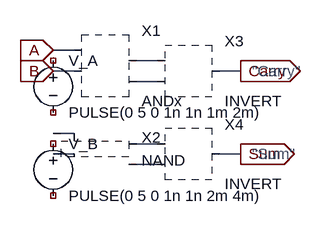
[diagram p0: schematic half-adder-test.asc]
half-adder-test.asc, the LTspice schematic file:
Version 4
SHEET 1 880 680
* Input A path
WIRE 176 128 144 128
WIRE 176 160 144 160
WIRE 304 144 272 144
WIRE 304 176 272 176

* Input B path
WIRE 176 256 144 256
WIRE 176 288 144 288
WIRE 304 272 272 272
WIRE 304 304 272 304

* Output paths
WIRE 432 160 400 160
WIRE 432 288 400 288

* Input flags
FLAG 144 128 A
IOPIN 144 128 In
FLAG 144 160 B
IOPIN 144 160 In

* Output flags
FLAG 432 160 Carry
IOPIN 432 160 Out
FLAG 432 288 Sum
IOPIN 432 288 Out

* Gate symbols with consistent spacing
SYMBOL ANDx 224 144 R0
SYMATTR InstName X1

SYMBOL NAND 224 272 R0
SYMATTR InstName X2
Q
SYMBOL INVERT 352 144 R0
SYMATTR InstName X3

SYMBOL INVERT 352 272 R0
SYMATTR InstName X4

* Voltage sources (if needed for simulation)
SYMBOL voltage 144 128 R0
WINDOW 123 0 0 Left 0
WINDOW 39 0 0 Left 0
SYMATTR InstName V_A
SYMATTR Value PULSE(0 5 0 1n 1n 1m 2m)

SYMBOL voltage 144 256 R0
WINDOW 123 0 0 Left 0
WINDOW 39 0 0 Left 0
SYMATTR InstName V_B
SYMATTR Value PULSE(0 5 0 1n 1n 2m 4m)
* Text labels for clarity
TEXT 450 160 Left 2 "Carry"
TEXT 450 288 Left 2 "Sum"

The netlist it stands for:
* half-adder-test.asc
* X1: ANDx (symbol ANDx not available, pin order unknown); nets seen at it: A, B, N001, N002
* X2: NAND (symbol NAND not available, pin order unknown); nets seen at it: N003, N004, N005, N006
* X3: INVERT (symbol INVERT not available, pin order unknown); nets seen at it: Carry, N001, N002
* X4: INVERT (symbol INVERT not available, pin order unknown); nets seen at it: N005, N006, Sum
V_A NC_01 NC_02 PULSE(0 5 0 1n 1n 1m 2m)
V_B NC_03 NC_04 PULSE(0 5 0 1n 1n 2m 4m)
* "Carry"
* "Sum"
.backanno
.end